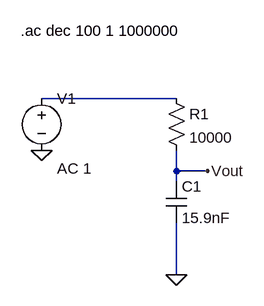
[diagram p0: schematic Q2.asc]
Q2.asc, the LTspice schematic file:
Version 4
SHEET 1 880 680
WIRE 288 64 80 64
WIRE 288 176 288 144
WIRE 336 176 288 176
WIRE 288 192 288 176
WIRE 288 336 288 256
FLAG 288 336 0
FLAG 80 144 0
FLAG 336 176 Vout
SYMBOL voltage 80 48 R0
WINDOW 123 24 124 Left 2
WINDOW 39 0 0 Left 0
SYMATTR InstName V1
SYMATTR Value ""
SYMATTR Value2 AC 1
SYMBOL cap 272 192 R0
SYMATTR InstName C1
SYMATTR Value 15.9nF
SYMBOL res 272 48 R0
SYMATTR InstName R1
SYMATTR Value 10000
TEXT 48 -40 Left 2 !.ac dec 100 1 1000000

The netlist it stands for:
* Q2.asc
V1 N001 0 AC 1
C1 Vout 0 15.9nF
R1 N001 Vout 10000
.ac dec 100 1 1000000
.backanno
.end